# EAGLE schematic RFM12DipAdapter (EAGLE 6.5.0)
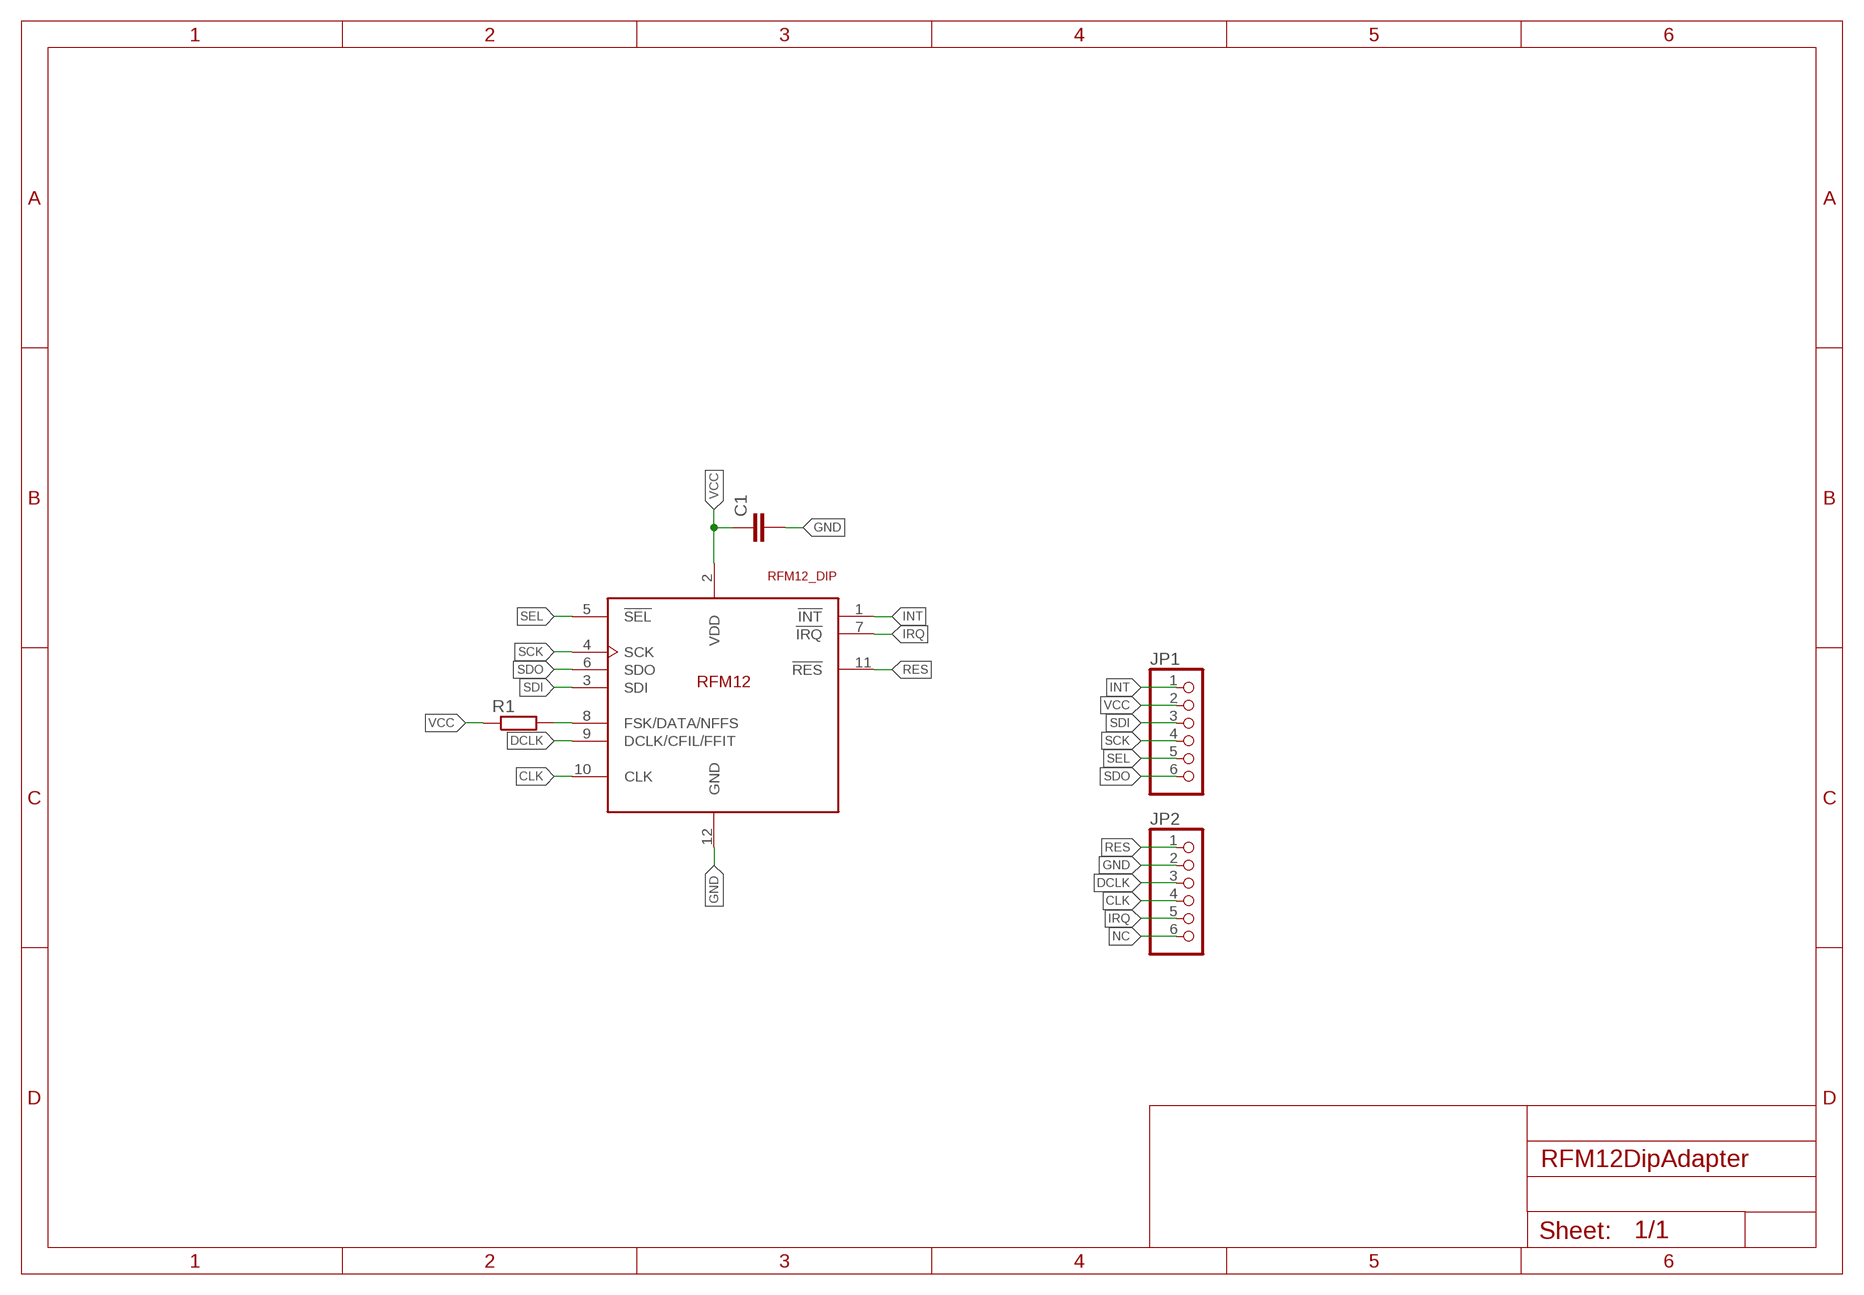
[diagram p0: schematic, sheet 1]

## Parts
C1  C-EUC0805  [C0805]
JP1  PINHD-1X6  [1X06]
JP2  PINHD-1X6  [1X06]
R1  R-EU_R1206  [R1206]
U$1  RFM12_DIP  [DIL-2MM-2X06]

## Nets
CLK: JP2.4 U$1.10(CLK)
DCLK: JP2.3 U$1.9(DCLK/CFIL/FFIT)
GND: C1.2 JP2.2 U$1.12(GND)
INT: JP1.1 U$1.1(!INT)
IRQ: JP2.5 U$1.7(!IRQ)
N$1: R1.2 U$1.8(FSK/DATA/NFFS)
NC: JP2.6
RES: JP2.1 U$1.11(!RES)
SCK: JP1.4 U$1.4(SCK)
SDI: JP1.3 U$1.3(SDI)
SDO: JP1.6 U$1.6(SDO)
SEL: JP1.5 U$1.5(!SEL)
VCC: C1.1 JP1.2 R1.1 U$1.2(VDD)

## Library data of the parts
C1 = rcl:C-EU: CAPACITOR, European symbol
JP1 JP2 = pinhead:PINHD-1X6: PIN HEADER
R1 = rcl:R-EU_: RESISTOR, European symbol
U$1 = rfm_12:RFM12_DIP: RFM12 is a low costing ISM band transceiver module implemented with unique PLL. It works signal ranges from 315/433/868/915MHZ bands, comply with FCC, ETSI regulation. The SPI interface is used to communicate with microcontroller for parameter setting.